# EAGLE design 214_oled_10 (EAGLE 9.6.0)
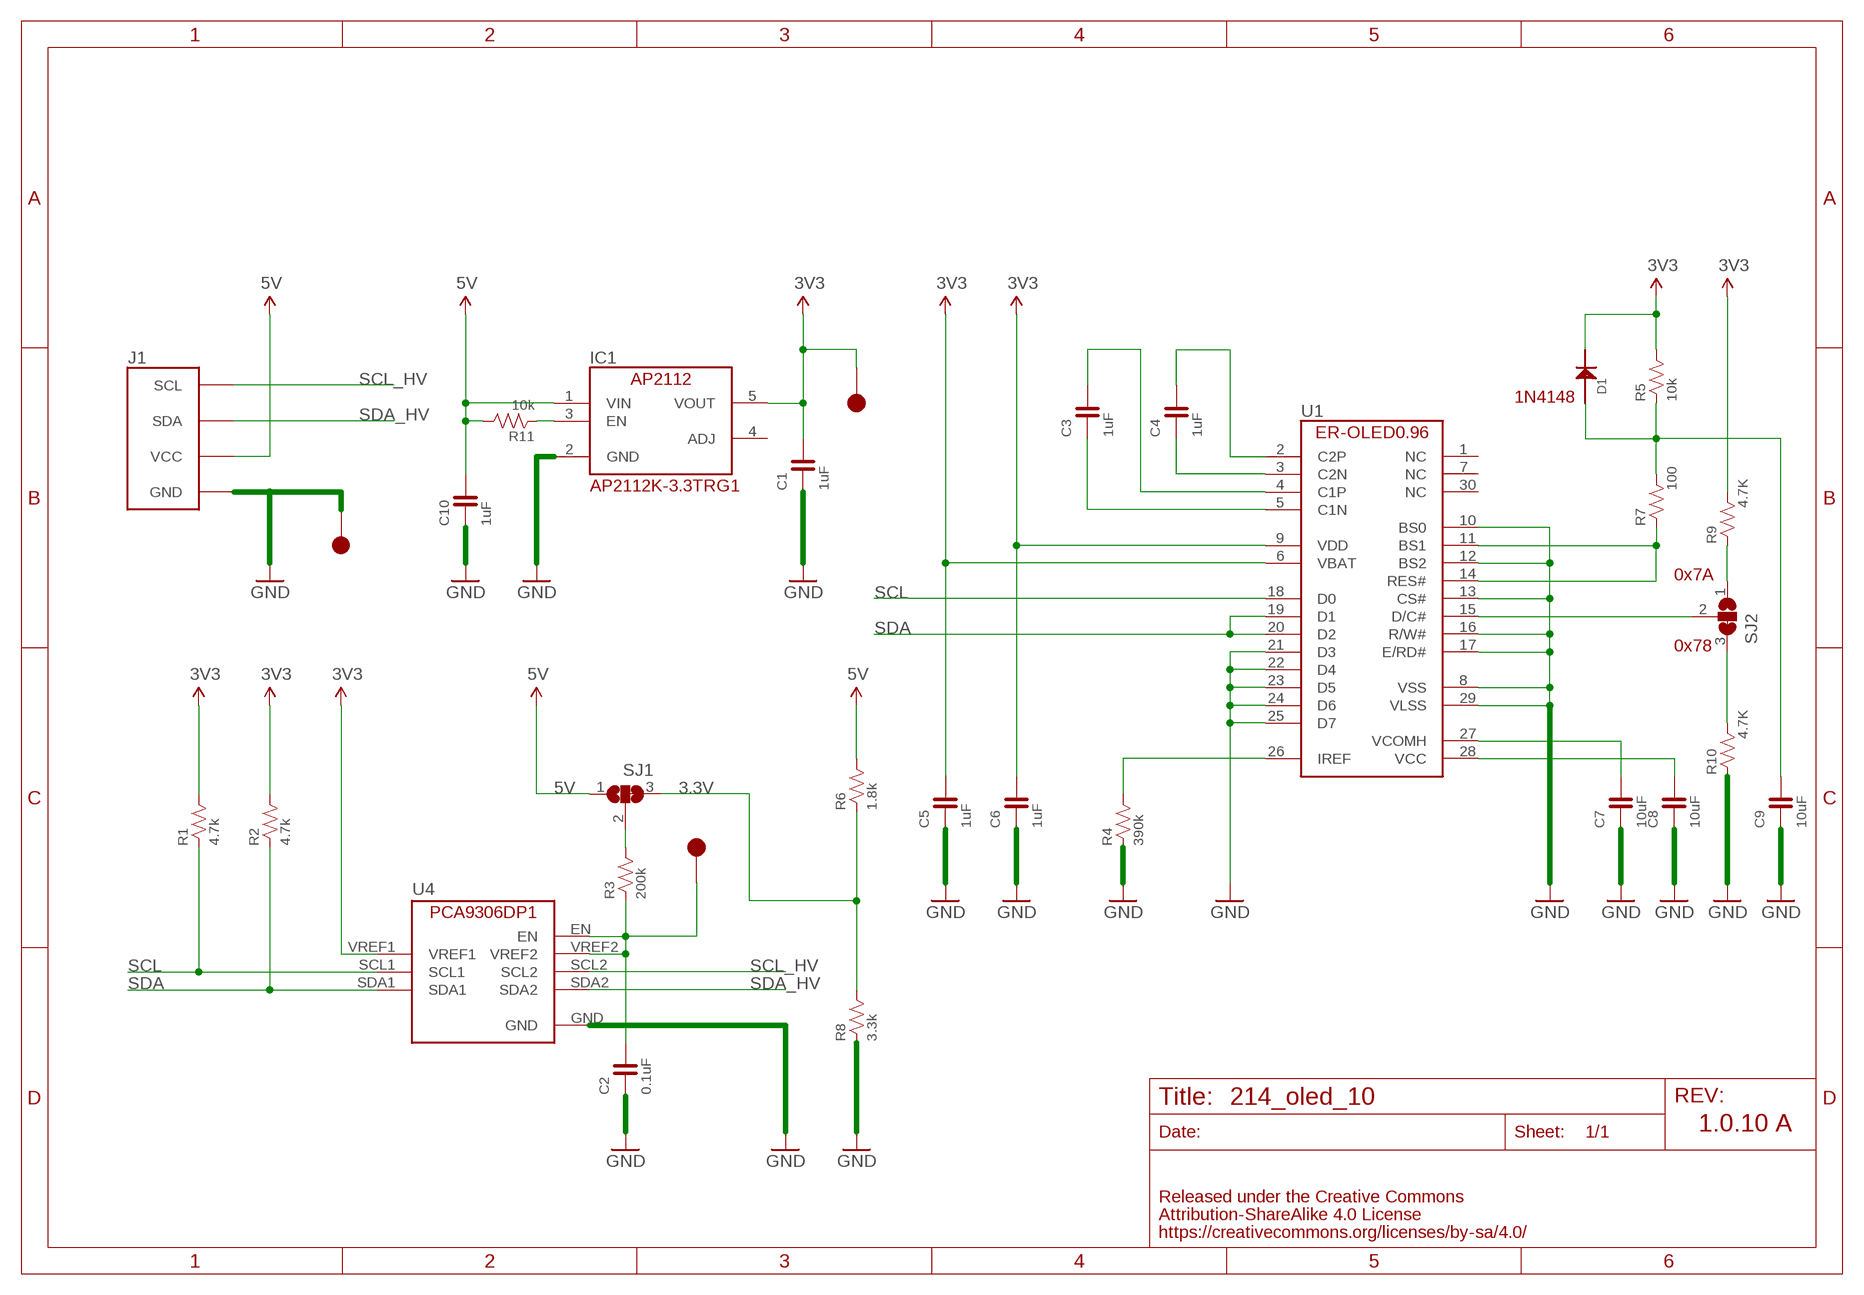
[diagram p0: schematic, sheet 1]

## Parts
C1  1uF  CAPACITOR-0603  [0603]
C2  0.1uF  CAPACITOR-0603  [0603]
C3  1uF  CAPACITOR-0603  [0603]
C4  1uF  CAPACITOR-0603  [0603]
C5  1uF  CAPACITOR-0603  [0603]
C6  1uF  CAPACITOR-0603  [0603]
C7  10uF  CAPACITOR-0603  [0603]
C8  10uF  CAPACITOR-0603  [0603]
C9  10uF  CAPACITOR-0603  [0603]
C10  1uF  CAPACITOR-0603  [0603]
D1  1N4148  [1N4148W]
IC1  AP2112K-3.3TRG1  [SOT-23-5]
J1  FABO_BRICK_I2C-OLED  [FABO_BRICK_I2C_OLED]
R1  4.7k  RESISTOR-0603  [0603]
R2  4.7k  RESISTOR-0603  [0603]
R3  200k  RESISTOR-0603  [0603]
R4  390k  RESISTOR-0603  [0603]
R5  10k  RESISTOR-0603  [0603]
R6  1.8k  RESISTOR-0603  [0603]
R7  100  RESISTOR-0603  [0603]
R8  3.3k  RESISTOR-0603  [0603]
R9  4.7K  RESISTOR-0603  [0603]
R10  4.7K  RESISTOR-0603  [0603]
R11  10k  RESISTOR-0603  [0603]
SJ1  SJ2W  [SJ_2]
SJ2  SJ2W  [SJ_2]
TP1  TP-15  [TP-15]
TP2  TP-15  [TP-15]
TP5  TP-15  [TP-15]
U1  ER-OLED0.96-1ER-CON30HT-1  [ER-CON30HT-1]
U4  PCA9306DP1  [TSSOP8]

## Nets
3.3V: R6.1 R8.2 SJ1.3
3V3: C1.2 C5.2 C6.2 D1.CATHODE IC1.5(VOUT) R1.2 R2.2 R5.2 R9.2 TP5.1 U1.6(VBAT) U1.9(VDD) U4.VREF1
5V: C10.2 IC1.1(VIN) J1.VCC R6.2 R11.2 SJ1.1
GND: C1.1 C2.1 C5.1 C6.1 C7.1 C8.1 C9.1 C10.1 IC1.2(GND) J1.GND R4.1 R8.1 R10.1 TP1.1 U1.8(VSS) U1.10(BS0) U1.12(BS2) U1.13(CS#) U1.16(R/W#) U1.17(E/RD#) U1.21(D3) U1.22(D4) U1.23(D5) U1.24(D6) U1.25(D7) U1.29(VLSS) U4.GND
N$1: C3.2 U1.4(C1P)
N$2: C3.1 U1.5(C1N)
N$3: C4.1 U1.3(C2N)
N$4: C4.2 U1.2(C2P)
N$5: R4.2 U1.26(IREF)
N$6: C7.2 U1.27(VCOMH)
N$7: C8.2 U1.28(VCC)
N$8: C2.2 R3.1 TP2.1 U4.EN U4.VREF2
N$9: R3.2 SJ1.2
N$10: R7.1 U1.11(BS1) U1.14(RES#)
N$11: IC1.3(EN) R11.1
N$12: C9.2 D1.ANODE R5.1 R7.2
N$13: SJ2.2 U1.15(D/C#)
N$14: R10.2 SJ2.3
N$15: R9.1 SJ2.1
SCL: R1.1 U1.18(D0) U4.SCL1
SCL_HV: J1.SCL U4.SCL2
SDA: R2.1 U1.19(D1) U1.20(D2) U4.SDA1
SDA_HV: J1.SDA U4.SDA2
Unconnected: IC1.4(ADJ) U1.1(NC) U1.7(NC) U1.30(NC)

## Notes on the sheet
- 1N4148
- AP2112K-3.3TRG1
- 0x7A
- 0x78
- 1.0.10 A

## Library data of the parts
C1-C10 = FaBo-Capacitor:CAPACITOR: CAPACITOR
D1 = FaBo-Diode:1N4148
IC1 = FaBo-Supply:AP2112
J1 = FaBo-Template:FABO_BRICK_I2C: FaBo Brick I2C
R1-R11 = FaBo-Resistors:RESISTOR: RESISTOR
SJ1 SJ2 = jumper:SJ2W: SMD solder JUMPER
TP1 TP2 TP5 = FaBo-Supply:TP
U1 = FaBo-Display:ER-OLED0.96-1
U4 = FaBo-LevelTranslator:PCA9306DP1

## Board
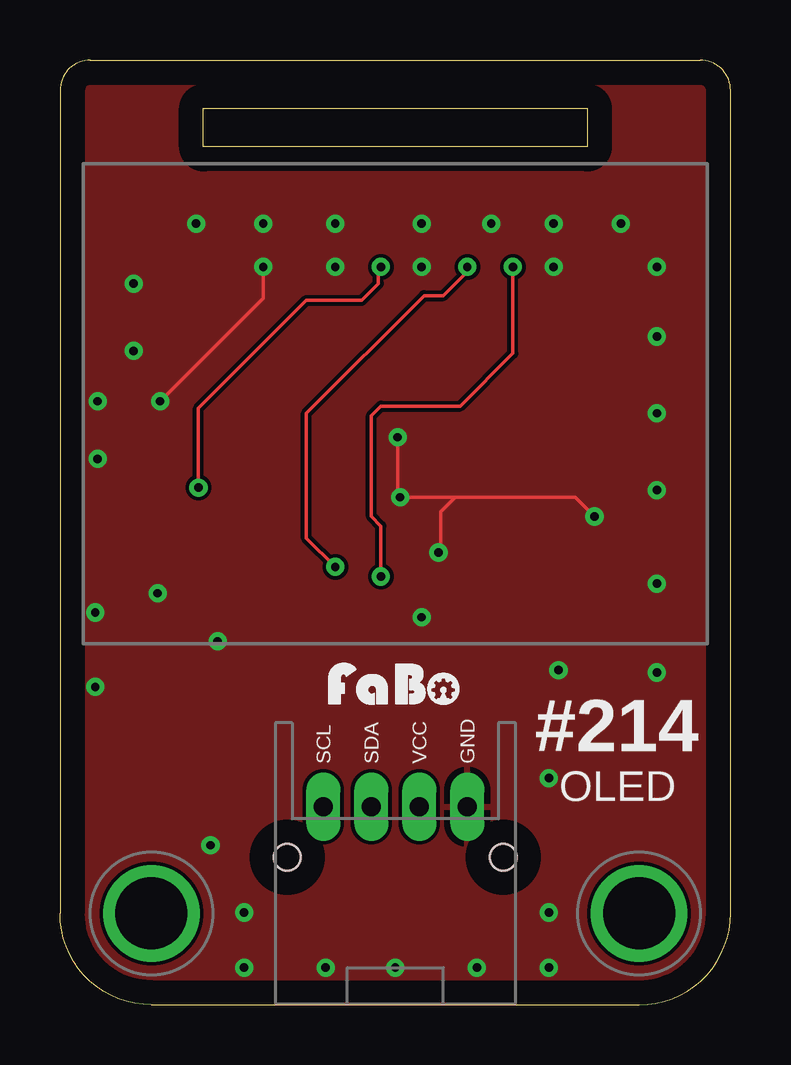
[diagram p1: board, top side]
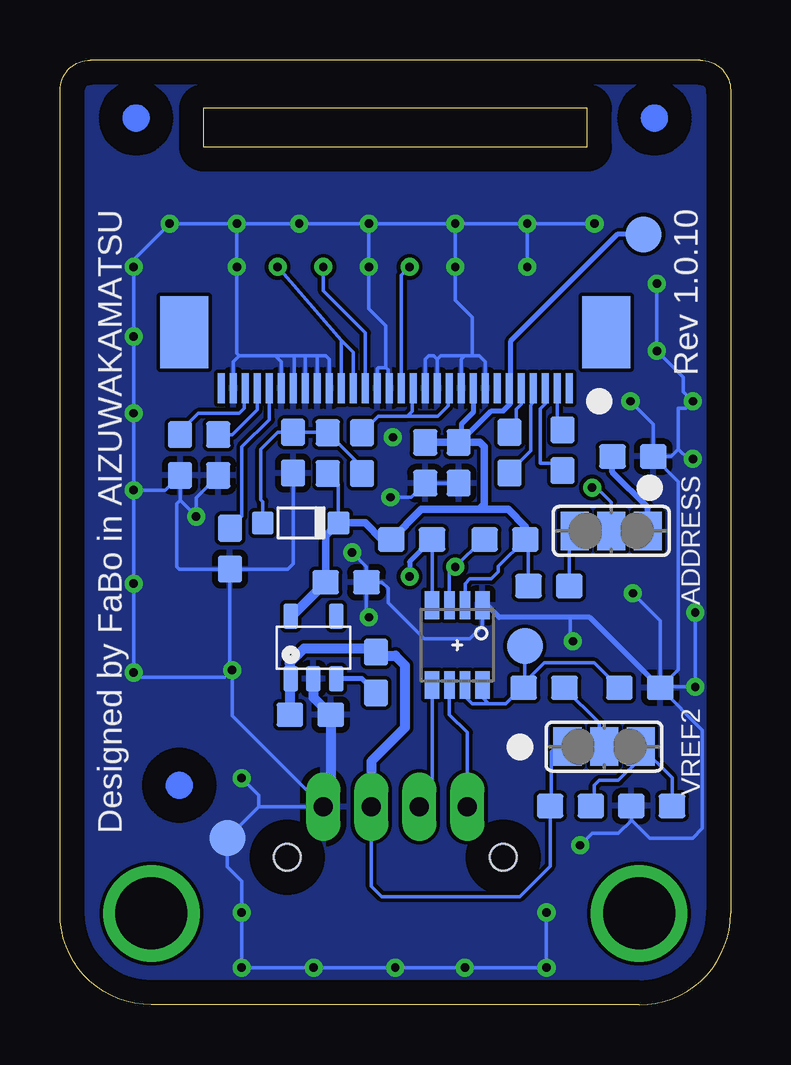
[diagram p2: board, bottom side, seen from below]

Size 27.94 x 39.37 mm. Coordinates in mm from the lower left corner, seen from the top.
Outline: 5.97,37.35 21.97,37.35 21.97,35.75 5.97,35.75 5.97,37.35
Copper layers (1*16): Top 0.035mm / dielectric 1.5mm / Bottom 0.035mm
Design rules "default": minimum track width 6mil, minimum drill 0.35mm, track to track 6mil, track to pad 6mil, pad to pad 6mil, via to via 6mil, smd to smd 6mil, copper to edge 40mil, drill to drill 6mil, minimum pad ring 10mil, minimum via ring 8mil, stop-mask expansion 4mil, vias tented up to drill 0mil, thermal gap 10mil
bRestrict: area 12.4,24.9 to 12.6,26.4; area 14.4,24.9 to 14.6,26.4; area 16.9,24.9 to 17.1,26.4; area 17.4,24.9 to 17.6,26.4; area 17.9,24.9 to 18.1,26.4; area 18.4,24.9 to 18.6,26.4

### Footprints (pad centres in the part's own frame; a part is rotated, then mirrored left to right if it is on the bottom)
0603 = smd 1.1 x 1: 1 -0.85,0; 2 0.85,0
1N4148W = smd 0.9 x 0.95: ANODE 0,0; CATHODE 3.15,0
SOT-23-5 = smd 0.6 x 1.05: 1 -0.95,-1.3; 2 0,-1.3; 3 0.95,-1.3; 4 0.95,1.3; 5 -0.95,1.3
FABO_BRICK_I2C_OLED = drill 0.8 pad 1.422 long: GND 3,-10.795; SCL -3,-10.795; SDA -1,-10.795; VCC 1,-10.795 | drill 3 pad 3.81: P$1 -10.16,-15.24; P$2 10.16,-15.24 | hole 1.1: -4.5,-12.895; 4.5,-12.895
SJ_2 = smd 1.168 x 1.6: 1 -1.524,0; 2 0,0; 3 1.524,0
TP-15 = smd 1.5 x 1.5: 1 0,0
ER-CON30HT-1 = smd 0.3 x 1.25 bottom: 1 7,-0.23; 2 6.5,-0.23; 3 6,-0.23; 4 5.5,-0.23; 5 5,-0.23; 6 4.5,-0.23; 7 4,-0.23; 8 3.5,-0.23; 9 3,-0.23; 10 2.5,-0.23; 11 2,-0.23; 12 1.5,-0.23; 13 1,-0.23; 14 0.5,-0.23; 15 0,-0.23; 16 -0.5,-0.23; 17 -1,-0.23; 18 -1.5,-0.23; 19 -2,-0.23; 20 -2.5,-0.23; 21 -3,-0.23; 22 -3.5,-0.23; 23 -4,-0.23; 24 -4.5,-0.23; 25 -5,-0.23; 26 -5.5,-0.23; 27 -6,-0.23; 28 -6.5,-0.23; 29 -7,-0.23; 30 -7.5,-0.23 | smd 2 x 3 bottom: 31 -9.04,-2.555; 32 8.54,-2.555
TSSOP8 = smd 0.6 x 1.15: EN -1.05,1.663; GND -1.05,-1.663; SDA1 1.05,-1.663; SDA2 1.05,1.663 | smd 0.45 x 1.15: SCL1 0.325,-1.663; SCL2 0.325,1.663; VREF1 -0.325,-1.663; VREF2 -0.325,1.663

### Placement (x,y rotation side)
C1  16.02,17.61 180 bottom
C2  3.78,13.21 180 bottom
C3  9.21,23.01 270 bottom
C4  7,23.11 90 bottom
C5  11.33,22.59 90 bottom
C6  12.72,22.59 90 bottom
C7  21.35,22.91 90 bottom
C8  22.94,22.91 90 bottom
C9  18.23,23.01 90 bottom
C10  17.51,12.09 180 bottom
D1  19.49,20.08 0 bottom
IC1  17.38,14.89 0 bottom
J1  13.97,19.05 0 top
R1  9.4,19.39 0 bottom
R2  13.29,19.39 180 bottom
R3  7.77,13.21 0 bottom
R4  20.86,19.01 90 bottom
R5  16.78,22.99 270 bottom
R6  6.67,8.29 180 bottom
R7  15.36,22.99 270 bottom
R8  3.29,8.29 0 bottom
R9  7.57,17.45 180 bottom
R10  4.07,22.85 180 bottom
R11  14.77,13.85 90 bottom
SJ1  5.27,10.76 0 bottom
SJ2  4.97,19.75 0 bottom
TP1  20.97,6.95 0 bottom
TP2  8.57,14.95 0 bottom
TP5  3.62,32.1 0 bottom
U1  13.72,25.47 180 top
U4  11.39,14.99 180 bottom
U$3  [MARK_POINT_3MM]  24.77,36.95 0 bottom
U$4  [MARK_POINT_3MM]  22.97,9.15 0 bottom
U$5  [MARK_POINT_3MM]  3.17,36.95 0 bottom
U$6  [LOGO_FABO_S]  13.97,12.35 0 top

### Tracks (layer width: path | path; a pad name or v marks a point on that pad's centre or on a via)
3.3V
  Bottom 0.152: R6.1 5.67,8.44 5.67,9.15 5.47,9.35 4.67,9.35 3.75,10.27 SJ1.3 2.44,9.45 R8.2
3V3
  Bottom 0.152: 9.17,25.65 U1.6 | R5.2 16.34,21.7 D1.CATHODE | R9.2 8.42,19.26 R1.2 9.67,18.27 9.67,18.05 9.97,17.75 10.87,17.75 11.07,17.55 U4.VREF1
  Bottom 0.2: C5.2 11.28,23.44 11.22,23.5 9.97,24.75 9.47,24.75 9.17,25.05 9.17,25.65 9.17,27.65 4.72,32.1 TP5.1
  Bottom 0.203: U1.9 10.72,24.7 11.22,24.2 11.22,23.5
  Bottom 0.305: C1.2 16.87,19.55 D1.CATHODE 15.23,20.08 14.54,19.39 R2.2 12.88,20.65 10.47,20.65 | R1.2 8.55,19.93 9.27,20.65 10.47,20.65 | 10.47,20.65 10.27,20.85 10.27,23.25 10.46,23.44 C5.2 C6.2
  Bottom 0.406: C1.2 18.29,16.19 IC1.5
5V
  Bottom 0.152: J1.VCC 14.97,4.95 14.53,4.51 8.79,4.51 7.52,5.78 R6.2 7.47,8.34 7.47,10.55 7.26,10.76 SJ1.1
  Bottom 0.406: C10.2 18.36,13.56 IC1.1 18.37,13.63 18.37,14.25 17.77,14.85 14.92,14.85 R11.2 14.62,14.55 13.97,14.55 13.57,14.15 13.57,11.55 14.97,10.15 J1.VCC
GND  (via drill 0.35)
  Top 0.152: v14.17,21.15 14.27,21.15 | 14.27,21.15 16.47,21.15 | 16.47,21.15 21.47,21.15 v22.27,20.35 | v15.77,18.85 15.87,18.95 15.87,20.55 16.47,21.15 | v4.17,25.15 8.47,29.45 v8.47,30.75 | v14.07,23.65 14.07,21.35 14.27,21.15
  Bottom 0.152: C2.1 1.17,11.45 1.17,7.35 1.57,6.95 3.37,6.95 4.14,7.72 | 4.14,7.72 R8.1 | U1.8 10.22,26.8 10.47,27.05 10.77,27.05 | 10.77,27.05 11.07,27.05 | 11.07,27.05 11.22,26.9 U1.10 | U1.12 12.22,26.9 | 12.22,26.9 12.37,27.05 12.57,27.05 12.72,26.9 U1.13 | R10.1 3.22,24.2 v4.17,25.15 | 18.77,25.65 U1.25 18.72,26.8 18.97,27.05 | 18.97,27.05 20.47,27.05 | 20.47,27.05 20.72,26.8 U1.29 | C5.1 C6.1 13.31,21.15 v14.17,21.15 | 10.34,16.85 U4.GND 10.34,15.78 10.87,15.25 12.77,15.25 14.27,16.75 14.27,17.35 14.53,17.61 C1.1 | 11.07,27.05 12.07,27.05 12.22,26.9 | 22.94,21.02 v22.27,20.35 22.27,21.14 C7.1 | 22.94,21.02 C8.1 23.55,21.45 v24.87,21.45 | R4.1 22.98,18.16 23.07,18.25 23.07,20.89 22.94,21.02 | C1.1 15.17,18.25 v15.77,18.85 | R10.1 2.17,21.8 2.17,13.97 C2.1 | C9.1 18.23,18.39 18.46,18.16 R4.1 | v24.87,21.45 v24.87,17.55 v24.87,13.85 24.67,13.65 21.07,13.65 v20.77,13.95 | C2.1 2.93,16.01 v4.07,17.15 | v11.47,32.55 v11.47,30.75 11.47,29.35 10.77,28.65 10.77,27.05 | v11.47,32.55 v15.07,32.55 | v15.07,32.55 v17.97,32.55 v20.57,32.55 | v20.57,32.55 v20.57,30.75 20.57,27.15 20.47,27.05 | v15.07,32.55 v15.07,30.75 15.07,29.01 14.36,28.3 14.36,26.55 | U1.17 14.72,26.5 14.67,26.55 14.36,26.55 | 14.36,26.55 14.27,26.46 14.27,25.75 U1.16 | v8.47,32.55 v11.47,32.55 | v8.47,32.55 v8.47,30.75 | v5.67,32.55 v8.47,32.55 | v20.57,32.55 v23.37,32.55 24.87,31.05 v24.87,30.75 v24.87,27.85 v24.87,24.65 v24.87,21.45 | U1.21 16.72,26.9 16.87,27.05 17.27,27.05 | 17.27,27.05 17.67,27.05 | 17.67,27.05 18.17,27.05 | 18.17,27.05 18.97,27.05 | U1.22 17.22,27 17.27,27.05 | U1.23 17.72,27 17.67,27.05 | U1.24 18.17,25.75 18.17,27.05 | R4.1 20.86,14.04 v20.77,13.95
  Bottom 0.152: v20.77,13.95 20.77,12.06 J1.GND 19.66,8.26 | 19.66,8.26 TP1.1 20.97,5.75 20.37,5.15 v20.37,3.85 v20.37,1.55 v17.37,1.55 v13.97,1.55 v11.07,1.55 v7.67,1.55 v7.67,3.85 | C2.1 2.89,13.25 v1.47,13.25 v1.47,16.35 | 2.17,23.15 2.17,24.85 1.87,24.85 v1.57,25.15 1.97,25.55 1.97,26.15 v3.07,27.25 v3.07,30.05 | 2.17,23.15 2.47,22.85 R10.1 | v1.57,22.75 1.77,22.75 2.17,23.15 | C1.1 15.17,16.25 v15.07,16.15 | v20.37,9.45 19.66,8.75 19.66,8.26 | v6.57,15.15 6.67,15.25 6.67,16.15 | v6.27,6.65 5.77,7.15 4.67,7.15 4.14,7.68 4.14,7.72
  Bottom 0.2: C2.1 5.87,16.15 6.67,16.15 9.64,16.15 10.34,16.85
  Bottom 0.406: J1.GND 16.66,8.57 C10.1 17.38,12.81 IC1.2
  pour Bottom: 1.07,38.95 26.37,38.95 27.47,37.85 27.47,2.95 24.77,0.25 3.27,0.25 0.37,3.15 0.37,38.25
  pour Top: 0.37,38.25 1.07,38.95 26.47,38.95 27.57,37.85 27.57,3.05 24.77,0.25 3.27,0.25 0.37,3.15
N$1
  Bottom 0.152: C3.2 9.21,22.21 8.33,23.09 8.33,24.99 8.22,25.1 U1.4
N$2
  Bottom 0.152: U1.5 8.72,25.03 8.94,24.81 8.94,24.13 C3.1
N$3
  Bottom 0.152: U1.3 7.72,25.05 7.93,24.85 7.93,22.56 7.3,22.56 C4.1
N$4
  Bottom 0.152: U1.2 7.22,24.18 C4.2
N$5
  Bottom 0.152: R4.2 20.36,20.36 20.36,23.25 19.22,24.39 U1.26
N$6
  Bottom 0.152: C7.2 20.76,23.76 19.72,24.8 U1.27
N$7
  Bottom 0.152: U1.28 20.27,25.65 20.27,24.85 20.47,24.65 22.17,24.65 22.94,23.88 C8.2
N$8
  Bottom 0.152: 10.07,12.55 9.37,12.55 8.71,13.21 R3.1 8.62,13.4 8.57,13.45 | U4.EN 10.34,12.82 10.07,12.55 | C2.2 5.67,14.25 7.77,14.25 8.57,13.45 | U4.VREF2 11.07,12.85 10.77,12.55 10.07,12.55 | TP2.1 8.57,13.45
N$9
  Bottom 0.152: SJ1.2 5.47,10.96 5.47,11.75 R3.2
N$10
  Bottom 0.152: U1.14 13.27,25.65 13.27,24.73 13.47,24.53 | U1.11 11.77,25.65 11.77,24.96 12.2,24.53 13.47,24.53 | R7.1 14.67,24.53 13.47,24.53
N$11
  Bottom 0.203: R11.1 15.36,13.59 IC1.3
N$12
  Bottom 0.152: R7.2 15.36,22.42 R5.1 16.8,23.86 C9.2 18.86,23.86 19.57,23.15 19.57,21.05 19.49,20.97 D1.ANODE
N$13  (via drill 0.35)
  Top 0.152: v13.37,30.75 13.27,30.65 13.27,30.05 12.57,29.35 10.27,29.35 5.77,24.85 v5.77,21.55
  Bottom 0.152: SJ2.2 4.97,20.95 5.57,21.55 v5.77,21.55 | v13.37,30.75 13.72,30.4 U1.15
N$14
  Bottom 0.254: SJ2.3 3.45,20.73 4.92,22.2 R10.2
N$15
  Bottom 0.152: SJ2.1 6.72,19.52 R9.1
SCL  (via drill 0.35)
  Top 0.152: v16.97,30.75 16.97,30.55 15.97,29.55 15.17,29.55 10.27,24.65 10.27,19.45 v11.47,18.25
  Bottom 0.152: 15.17,25.75 U1.18 15.22,28 16.97,29.75 v16.97,30.75 | 10.37,19.51 R1.1 10.33,19.39 v11.47,18.25 11.71,18 U4.SCL1
SCL_HV
  Bottom 0.152: J1.SCL 10.97,11.35 11.71,12.1 U4.SCL2
SDA  (via drill 0.35)
  Top 0.152: v13.37,17.85 13.37,19.95 12.97,20.35 12.97,24.55 13.37,24.95 16.67,24.95 18.87,27.15 v18.87,30.75
  Bottom 0.152: U4.SDA1 R2.1 | U1.19 15.72,27.2 16.22,27.7 | U1.20 16.22,27.7 | 16.22,27.7 v18.87,30.75
  Bottom 0.2: R2.1 13.37,18.46 v13.37,17.85
SDA_HV
  Bottom 0.152: 12.44,12.78 U4.SDA2 12.44,8.79 J1.SDA

### Text on the board
tPlace: #214 | OLED
bPlace: Rev 1.0.10 | Designed by FaBo in AIZUWAKAMATSU | ADDRESS | VREF2